# Altium schematic sheet Relays.SchDoc
size A4; SheetNumber: 5; SheetTotal: 6
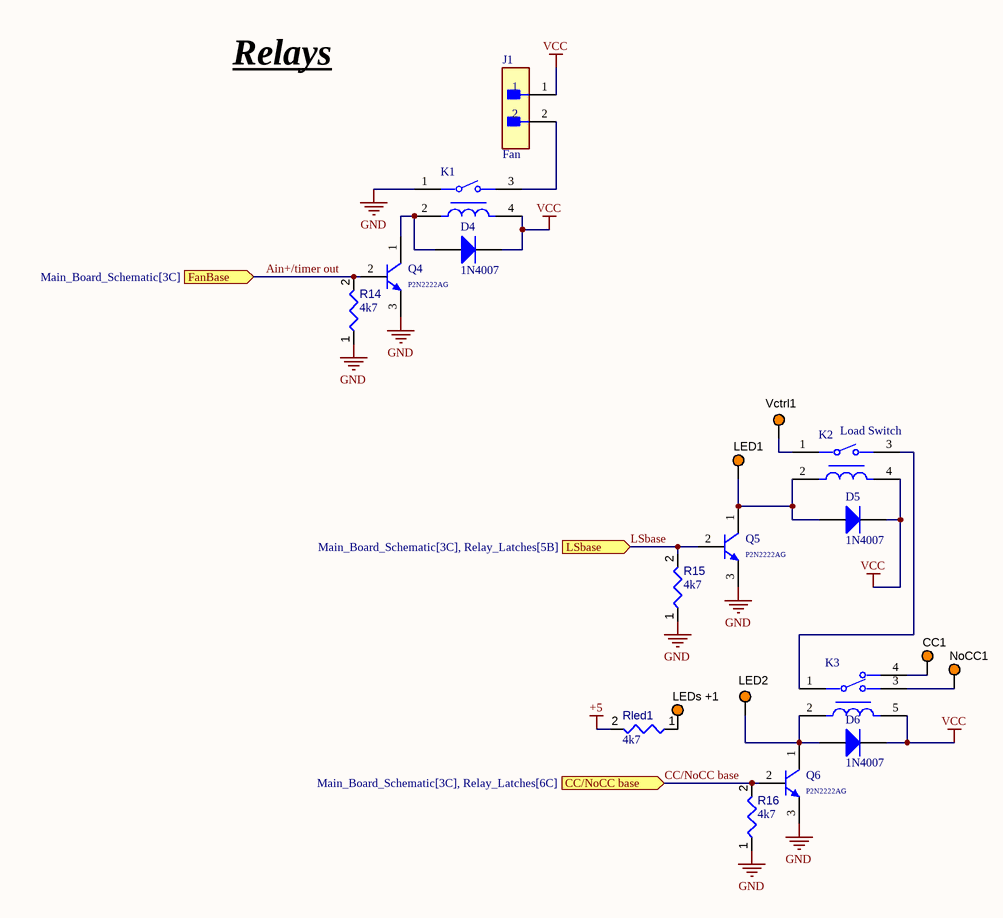
[diagram p0: Relays.SchDoc]

## Parts
CC1  5003  [KSTN-5003]  (value not drawn)
D4  1N4007  [FAIR-DO-41-2]
D5  1N4007  [FAIR-DO-41-2]
D6  1N4007  [FAIR-DO-41-2]
J1  Fan  [FP-B2B-XH-A_LF_SN-MFG]
K1  LKQ1AF-5V-TV-5  [FP-LKQ1AF-5V-TV-5-MFG]  (value not drawn)
K2  Load Switch  [FP-LKQ1AF-5V-TV-5-MFG]
K3  G5LE-14-36 DC12  [FP-G5LE-14-36_DC12-MFG]  (value not drawn)
LED1  5003  [KSTN-5003]  (value not drawn)
LED2  5003  [KSTN-5003]  (value not drawn)
LEDs_+1  5003  [KSTN-5003]  (value not drawn)
NoCC1  5003  [KSTN-5003]  (value not drawn)
Q4  P2N2222AG  [ONSC-TO-92-3-29-11]
Q5  P2N2222AG  [ONSC-TO-92-3-29-11]
Q6  P2N2222AG  [ONSC-TO-92-3-29-11]
R14  value 4k7  [RESA60-630X240]  (hidden comment: MFR-25FBF52-100R)
R15  value 4k7  [RESA60-630X240]  (hidden comment: MFR-25FBF52-100R)
R16  value 4k7  [RESA60-630X240]  (hidden comment: MFR-25FBF52-100R)
Rled1  value 4k7  [RESA60-630X240]  (hidden comment: MFR-25FBF52-100R)
Vctrl1  5003  [KSTN-5003]  (value not drawn)

## Ports
CC/NoCC base (in, see Main_Board_Schematic[3C], Relay_Latches[6C]), FanBase (in, see Main_Board_Schematic[3C]), LSbase (in, see Main_Board_Schematic[3C], Relay_Latches[5B])

## Nets
+5: Rled1.2
GND: K1.1 Q4.3(E) Q5.3(E) Q6.3(E) R14.1 R15.1 R16.1
VCC: D4.1(K) D5.1(K) D6.1(K) J1.1 K1.4 K2.4 K3.5
Ain+/timer out: Q4.2(B) R14.2 ; port FanBase
CC/NoCC base: Q6.2(B) R16.2 ; port CC/NoCC base
LSbase: Q5.2(B) R15.2 ; port LSbase
NetCC1_1: CC1.1 K3.4
NetD4_2: D4.2(A) K1.2 Q4.1(C)
NetD5_2: D5.2(A) K2.2 LED1.1 Q5.1(C)
NetD6_2: D6.2(A) K3.2 LED2.1 Q6.1(C)
NetJ1_2: J1.2 K1.3
NetK2_1: K2.1 Vctrl1.1
NetK2_3: K2.3 K3.1
NetK3_3: K3.3 NoCC1.1
NetLEDs_+1_1: LEDs_+1.1 Rled1.1

## Notes on the sheet
- Relays

## Library data of the parts
CC1 LED1 LED2 LEDs_+1 NoCC1 Vctrl1 = CMP-002-00037-2: Test Point, Orange, Height 4.6 mm, Tail Length 3 mm, 1-Pin THD, RoHS; Manufacturer: Keystone; Colour: Orange; Packaging: Bulk; Package Description: 1-Pin Through Hole Device, Dia 2.54 mm; Pins: 1; Package Reference: 5003; Datasheet Version: Jun-15; Case/Package: 5003; Mounting Technology: TH; Connector Type: TestPoint; Diameter: 2.54mm; Contact Material: Bronze; Datasheet URL: http://keyelco.com/userAssets/file/M65p56.pdf; Manufacturer URL: http://www.keyelco.com/; Package Quantity: 10; Contact Plating: Tin; RoHS Compliant: True
D4-D6 = CMP-004-00007-2: General Purpose Rectifier, 1.1 V, 1.0 A, -55 to 175 degC, 2-Pin DO-41, RoHS, Tape and Reel; Manufacturer: Fairchild; Peak Reverse Current: 5uA; Max Surge Current: 30A; Elements: 1; Forward Voltage: 1.1V; Package Version: Rev. 2, 09/2008; Forward Current: 1A; Package Quantity: 5000; Packaging: TapeandReel; Package URL: http://www.fairchildsemi.com/dwg/DO/DO41A.pdf; Manufacturer URL: https://www.fairchildsemi.com/; Package Reference: DO-41-2; Pins: 2; Min Operating Temperature: -55°C; Datasheet Version: Rev. 1.1.0, 11/2014; Max Operating Temperature: 175°C; RoHS Compliant: True; Case/Package: DO-41-2; Mounting Technology: TH; Package Description: 2-Pin Axial Lead, Dia 2.375 mm, Body Length 4.63 mm; Datasheet URL: https://www.fairchildsemi.com/datasheets/1N/1N4007.pdf
J1 = CMP-2000-05888-3: CONN HEADER VERT 2POS 2.5MM; Current Rating: 3A; Voltage Rating: 250V; Number of Contacts: 2; Contact Resistance: 20mR; Wire/Cable Gauge: 22AWG; Insulation Resistance: 1GR; Connector Type: Male Pin; Packaging: Bulk; Contact Material: Brass; Lead Free: Lead Free; Orientation: Straight; Contact Plating: Tin; Max Current Rating: 3A; Termination: Solder; Fastening Type: Detent; Depth: 5.75mm; Housing Material: Polyamide; REACH SVHC: No SVHC; Series: XH; Voltage Rating (AC): 250V; Number of Positions: 2; Color: Natural; Contact Type: Male Pin; Max Voltage Rating (DC): 250V; Pitch: 2.5mm; Lead Pitch: 2.5mm; Mount: Through Hole; Max Operating Temperature: 85°C; Length: 7.4mm; Max Voltage Rating (AC): 250V; Min Operating Temperature: -25°C; Number of Rows: 1; Housing Color: White
K1 K2 = CMP-008-00006-1: Quiet Type, High Sensitivity 250MW, Slim Power Relay
K3 = CMP-08822-000072-1: RELAY GEN PURPOSE SPDT 10A 12V; Coil Resistance: 400R; Release Time: 5ms; Max Voltage Rating (DC): 125V; Coil Current: 30mA; Coil Power: 360mW; Relay Type: General Purpose; Coil Type: Non-Latching; Max Voltage Rating (AC): 250V; Operate Time: 10ms; Package Quantity: 100; Number of Pins: 5; Mount: Through Hole; Termination: PC Pin; Series: G5LE; Min Operating Temperature: -25°C; Max Operating Temperature: 85°C; Throw Configuration: SPDT; Coil Voltage (DC): 12V; Radiation Hardening: No; Contact Current Rating: 10A; Packaging: Tray; Contact Material: Tin
Q4-Q6 = CMP-1048-01402-1: Amplifier Transistor, NPN Silicon, 3-Pin TO-92, Pb-Free, Bulk Box; Manufacturer: On Semiconductor; IC Continuous (A): 0.6; fT Min (MHz): 300; ComponentLink2Description: Datasheet; ComponentLink1Description: Manufacturer URL; ComponentLink2URL: http://www.onsemi.com/pub_link/Collateral/P2N2222A-D.PDF; ComponentLink3Description: Package Specification; RoHS: TRUE; ComponentLink1URL: http://www.onsemi.com/; PartNumber: P2N2222AG; Mounting Technology: Through Hole; PackageReference: TO-92-3-29-11_AM_SL; Polarity: NPN; Packing: Bulk Box; DatasheetVersion: Rev. 7; PackageDescription: 3-Pin Transistor Outline, Body 4.825 x 3.685 mm, Pitch 1.27 mm; PackageVersion: Rev. AM; ComponentLink3URL: http://www.onsemi.cn/pub_link/Collateral/2N6426-D.PDF
R14-R16 Rled1 = CMP-009-00046-4: Axial Resistor, 100 Ohm, +/- 1%, 0.25 W, -55 to 155 degC, 2-Pin THD, RoHS, Bulk; Manufacturer: Yageo; Voltage Rating: 250V; Power: 250mW; Packaging: Bulk; Max Operating Temperature: 155°C; Mounting Technology: TH; Datasheet Version: Apr-13; Case/Package: Axial; RoHS Compliant: True; Package Description: 2-Pin Axial Lead, Dia 2.4 mm, Body Length 6.3 mm; Package Quantity: 200; Package Reference: MFR-25; Tolerance: 1%; Composition: CarbonFilm; Datasheet URL: http://www.yageo.com/documents/recent/Yageo%20LR_MFR_2013.pdf; Manufacturer URL: http://www.yageo.com/; Min Operating Temperature: -55°C